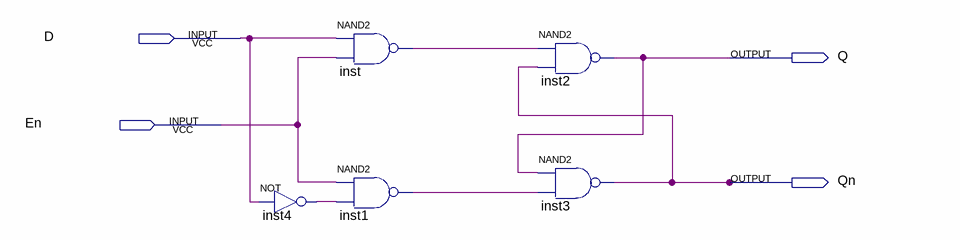
[diagram p0: schematic sheet]
// Quartus schematic LATCH_TIPO_D.bdf as structural Verilog: 5 symbols, 4 pins
module LATCH_TIPO_D (
  input  D,
  input  En,
  output Q,
  output Qn
);

  wire inst1_out, inst4_out, inst_out;

  not inst4 (inst4_out, D);
  nand inst (inst_out, D, En);
  nand inst1 (inst1_out, En, inst4_out);
  nand inst2 (Q, inst_out, Qn);
  nand inst3 (Qn, Q, inst1_out);
endmodule
